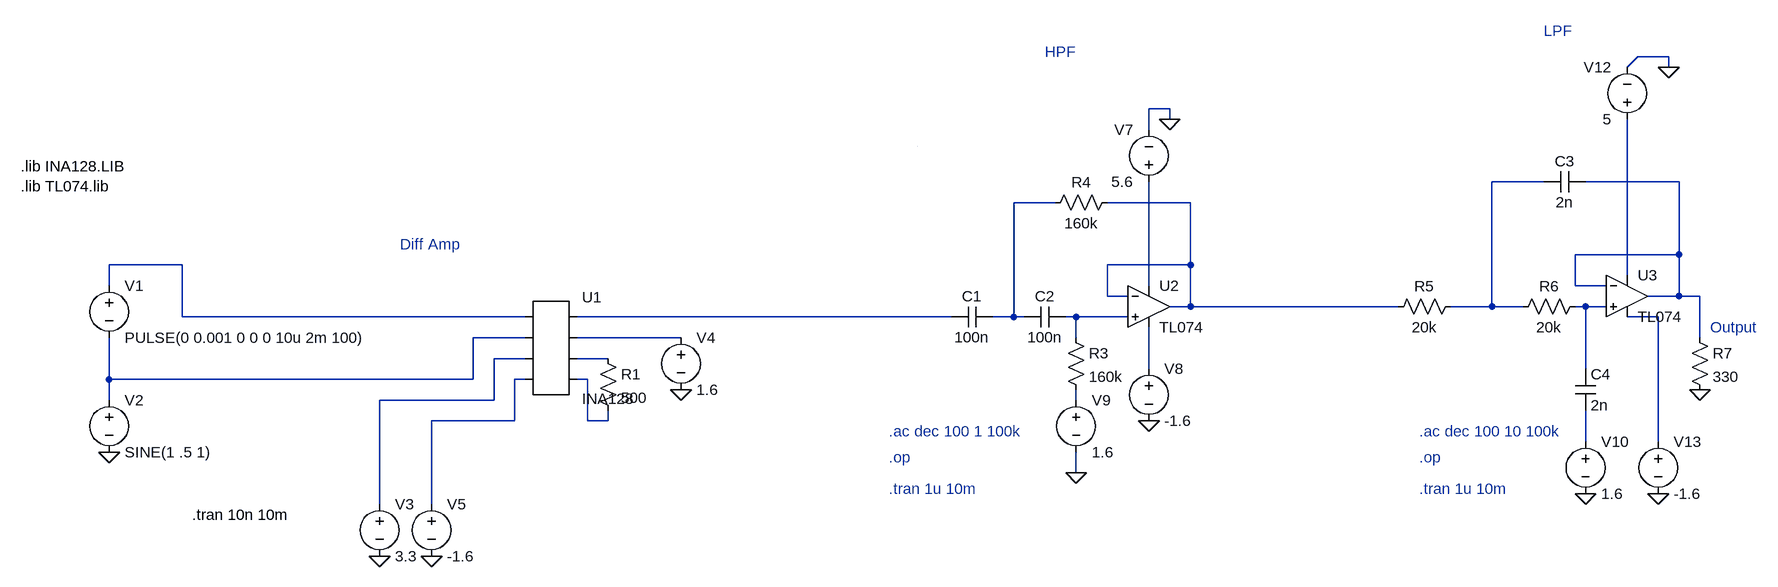
[diagram p0: schematic diffamp.asc]
diffamp.asc, the LTspice schematic file:
Version 4
SHEET 1 2640 680
WIRE 2496 -240 2448 -240
WIRE 2432 -224 2448 -240
WIRE 2496 -224 2496 -240
WIRE 1728 -160 1696 -160
WIRE 1728 -144 1728 -160
WIRE 1696 -128 1696 -160
WIRE 2304 -48 2224 -48
WIRE 2512 -48 2368 -48
WIRE 1552 -16 1488 -16
WIRE 1760 -16 1632 -16
WIRE 2512 64 2512 -48
WIRE 2512 64 2352 64
WIRE 208 80 96 80
WIRE 1760 80 1760 -16
WIRE 1760 80 1632 80
WIRE 2432 96 2432 -144
WIRE 96 112 96 80
WIRE 1696 112 1696 -48
WIRE 2352 112 2352 64
WIRE 2400 112 2352 112
WIRE 1632 128 1632 80
WIRE 1664 128 1632 128
WIRE 2512 128 2512 64
WIRE 2512 128 2464 128
WIRE 2544 128 2512 128
WIRE 1760 144 1760 80
WIRE 1760 144 1728 144
WIRE 2080 144 1760 144
WIRE 2224 144 2224 -48
WIRE 2224 144 2160 144
WIRE 2272 144 2224 144
WIRE 2368 144 2352 144
WIRE 2400 144 2368 144
WIRE 208 160 208 80
WIRE 736 160 208 160
WIRE 1392 160 816 160
WIRE 1488 160 1488 -16
WIRE 1488 160 1456 160
WIRE 1504 160 1488 160
WIRE 1584 160 1568 160
WIRE 1664 160 1584 160
WIRE 2480 160 2432 160
WIRE 736 192 656 192
WIRE 976 192 816 192
WIRE 1584 192 1584 160
WIRE 2544 192 2544 128
WIRE 736 224 688 224
WIRE 864 224 816 224
WIRE 1696 240 1696 176
WIRE 2368 240 2368 144
WIRE 96 256 96 192
WIRE 656 256 656 192
WIRE 656 256 96 256
WIRE 736 256 720 256
WIRE 832 256 816 256
WIRE 96 288 96 256
WIRE 688 288 688 224
WIRE 688 288 512 288
WIRE 1584 288 1584 272
WIRE 720 320 720 256
WIRE 720 320 592 320
WIRE 832 320 832 256
WIRE 864 320 864 304
WIRE 864 320 832 320
WIRE 2368 352 2368 304
WIRE 2480 352 2480 160
WIRE 1584 400 1584 368
WIRE 512 448 512 288
WIRE 592 448 592 320
FLAG 96 368 0
FLAG 512 528 0
FLAG 976 272 0
FLAG 592 528 0
FLAG 1728 -144 0
FLAG 1696 320 0
FLAG 1584 400 0
FLAG 2368 432 0
FLAG 2480 432 0
FLAG 2496 -224 0
FLAG 2544 272 0
SYMBOL voltage 96 96 R0
WINDOW 39 0 0 Left 0
SYMATTR InstName V1
SYMATTR Value PULSE(0 0.001 0 0 0 10u 2m 100)
SYMBOL voltage 96 272 R0
SYMATTR InstName V2
SYMATTR Value SINE(1 .5 1)
SYMBOL voltage 512 432 R0
SYMATTR InstName V3
SYMATTR Value 3.3
SYMBOL voltage 976 176 R0
SYMATTR InstName V4
SYMATTR Value 1.6
SYMBOL AutoGenerated/INA128 768 208 R0
SYMATTR InstName U1
SYMBOL Res 848 208 R0
SYMATTR InstName R1
SYMATTR Value 500
SYMBOL voltage 592 432 R0
SYMATTR InstName V5
SYMATTR Value -1.6
SYMBOL cap 1456 144 R90
WINDOW 0 0 32 VBottom 2
WINDOW 3 32 32 VTop 2
SYMATTR InstName C1
SYMATTR Value 100n
SYMATTR SpiceLine Lser=0 mfg="   ---" pn="   ---" type="   ---"
SYMBOL cap 1568 144 R90
WINDOW 0 0 32 VBottom 2
WINDOW 3 32 32 VTop 2
SYMATTR InstName C2
SYMATTR Value 100n
SYMATTR SpiceLine Lser=408p mfg="   ---" pn="   ---" type="   ---"
SYMBOL Res 1568 176 R0
SYMATTR InstName R3
SYMATTR Value 160k
SYMBOL Res 1648 -32 R90
WINDOW 0 0 56 VBottom 2
WINDOW 3 32 56 VTop 2
SYMATTR InstName R4
SYMATTR Value 160k
SYMBOL voltage 1696 -32 R180
WINDOW 0 24 96 Left 2
WINDOW 3 24 16 Left 2
SYMATTR InstName V7
SYMATTR Value 5.6
SYMBOL voltage 1696 224 R0
SYMATTR InstName V8
SYMATTR Value -1.6
SYMBOL OpAmps/opamp2 1696 80 R0
SYMATTR InstName U2
SYMATTR Value TL074
SYMBOL voltage 1584 272 R0
SYMATTR InstName V9
SYMATTR Value 1.6
SYMBOL Res 2176 128 R90
WINDOW 0 0 56 VBottom 2
WINDOW 3 32 56 VTop 2
SYMATTR InstName R5
SYMATTR Value 20k
SYMBOL Res 2368 128 R90
WINDOW 0 0 56 VBottom 2
WINDOW 3 32 56 VTop 2
SYMATTR InstName R6
SYMATTR Value 20k
SYMBOL cap 2368 -64 R90
WINDOW 0 0 32 VBottom 2
WINDOW 3 32 32 VTop 2
SYMATTR InstName C3
SYMATTR Value 2n
SYMATTR SpiceLine Rser=52.6m Lser=228p mfg="   ---" pn="   ---" type="   ---"
SYMBOL OpAmps/opamp2 2432 64 R0
SYMATTR InstName U3
SYMATTR Value TL074
SYMBOL cap 2352 240 R0
SYMATTR InstName C4
SYMATTR Value 2n
SYMATTR SpiceLine Rser=52.5m Lser=416p mfg="   ---" pn="   ---" type="   ---"
SYMBOL voltage 2368 336 R0
SYMATTR InstName V10
SYMATTR Value 1.6
SYMBOL voltage 2432 -128 R180
WINDOW 0 24 96 Left 2
WINDOW 3 24 16 Left 2
SYMATTR InstName V12
SYMATTR Value 5
SYMBOL voltage 2480 336 R0
SYMATTR InstName V13
SYMATTR Value -1.6
SYMBOL Res 2528 176 R0
SYMATTR InstName R7
SYMATTR Value 330
TEXT 224 464 Left 2 !.tran 10n 10m
TEXT -40 -72 Left 2 !.lib INA128.LIB\n.lib TL074.lib
TEXT 1296 336 Left 2 ;.ac dec 100 1 100k
TEXT 1296 376 Left 2 ;.op
TEXT 1296 424 Left 2 ;.tran 1u 10m
TEXT 2112 336 Left 2 ;.ac dec 100 10 100k
TEXT 2112 376 Left 2 ;.op
TEXT 2112 424 Left 2 ;.tran 1u 10m
TEXT 544 48 Left 2 ;Diff Amp
TEXT 1536 -248 Left 2 ;HPF
TEXT 2304 -280 Left 2 ;LPF
TEXT 2560 176 Left 2 ;Output
ARC Normal 1340 -92 1332 -112 1620 -136 1516 -144 2

The netlist it stands for:
* diffamp.asc
V1 N005 N012 PULSE(0 0.001 0 0 0 10u 2m 100)
V2 N012 0 SINE(1 .5 1)
V3 N014 0 3.3
V4 N013 0 1.6
* U1: INA128 (symbol AutoGenerated/INA128 not available, pins judged from their places): pin1=N005 pin2=N012 pin3=N014 pin4=N017 pin5=N009 pin6=N013 pin7=N015 pin8=N018
R1 N015 N018 500
V5 N017 0 -1.6
C1 N003 N009 100n Lser=0 mfg="   ---" pn="   ---" type="   ---"
C2 N010 N003 100n Lser=408p mfg="   ---" pn="   ---" type="   ---"
R3 N010 N019 160k
R4 N004 N003 160k
V7 N007 0 5.6
V8 N016 0 -1.6
XU2 N010 N004 N007 N016 N004 TL074  ; pins In+ In- V+ V- OUT
V9 N019 0 1.6
R5 N001 N004 20k
R6 N008 N001 20k
C3 N002 N001 2n Rser=52.6m Lser=228p mfg="   ---" pn="   ---" type="   ---"
XU3 N008 N002 N006 N011 N002 TL074  ; pins In+ In- V+ V- OUT
C4 N008 N020 2n Rser=52.5m Lser=416p mfg="   ---" pn="   ---" type="   ---"
V10 N020 0 1.6
V12 N006 0 5
V13 N011 0 -1.6
R7 N002 0 330
.tran 10n 10m
.lib INA128.LIB
.lib TL074.lib
* .ac dec 100 1 100k
* .op
* .tran 1u 10m
* .ac dec 100 10 100k
* .op
* .tran 1u 10m
* Diff Amp
* HPF
* LPF
* Output
.backanno
.end